# EAGLE schematic Lab3 (EAGLE 6.2)
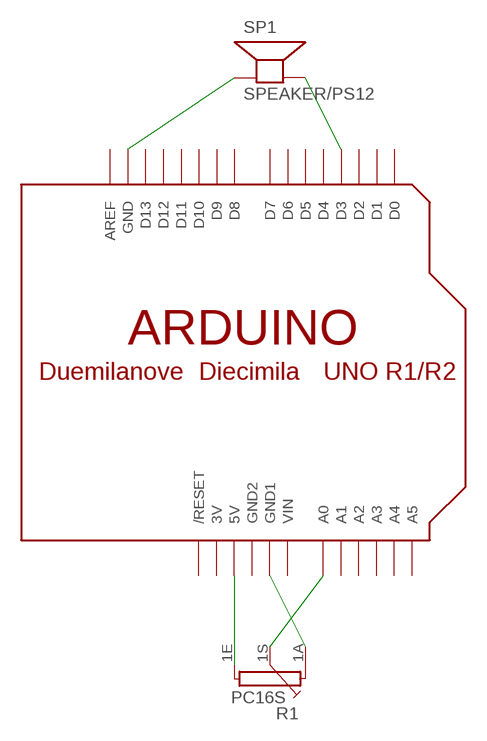
[diagram p0: schematic, sheet 1]

## Parts
R1  PC16S  [PC16S]
SP1  SPEAKER/PS12  [PS12]
U$1  ARDUINO-BPLACE  [ARDUINO-BPLACE]

## Nets
N$1: R1.1S U$1.A0
N$2: R1.1A U$1.GND1
N$3: U$1.5V
N$4: SP1.P$2(-) U$1.D3
N$5: SP1.P$1(+) U$1.GND
Unconnected: R1.1E U$1.A1 U$1.A2 U$1.A3 U$1.A4 U$1.A5 U$1.AREF U$1.D0 U$1.D1 U$1.D2 U$1.D4 U$1.D5 U$1.D6 U$1.D7 U$1.D8 U$1.D9 U$1.D10 U$1.D11 U$1.D12 U$1.D13 U$1.RESET(/RESET)

## Power pins joined to a net without a drawn wire
3V: U$1.3V
GND2: U$1.GND2
VIN: U$1.VIN

## Library data of the parts
R1 = piher:PC16S: POTENTIOMETER single carbon potentiometer, 16 mm, S3ROH; OC_FARNELL: 4452940; OC_NEWARK: unknown
SP1 = adafruit:SPEAKER: SPEAKER Source: Buerklin Added PS12 (for part # PS1240 piezo) http://www.ladyada.net/library/pcb/eaglelibrary.html
U$1 = adafruit:ARDUINO: Arduino Diecimila/Duemilanove Make a shield with ease, this package has all the named pins as well as the two mounting drill holes and an outline of the USB and DC power connector. The outline is on the DIMENSION layer, so if your board house uses it they will cut the outline to match. http://www.ladyada.net/library/pcb/eaglelibrary.html